# Altium schematic sheet Sheet1.SchDoc
size A; SheetNumber: 1; SheetTotal: 1; Rule: UNIONINDEX=0|RULEKIND=Width|NETSCOPE=AnyNet|LAYERKIND=SameLayer|NAME=Schematic Width Constraint|MAXLIMIT=30mil|MINLIMIT=30mil|PREFEREDWIDTH=30mil|MIDLAYER1_MINWIDTH=10mil|MIDLAYER1_MAXWIDTH=10mil|MIDLAYER1_PREFWIDTH=10mil|MIDLAYER2_MINWIDTH=10mil|MIDLAYER2_MAXWIDTH=10mil|MIDLAYER2_PREFWIDTH=10mil|MIDLAYER3_MINWIDTH=10mil|MIDLAYER3_MAXWIDTH=10mil|MIDLAYER3_PREFWIDTH=10mil|MIDLAYER4_MINWIDTH=10mil|MIDLAYER4_MAXWIDTH=10mil|MIDLAYER4_PREFWIDTH=10mil|MIDLAYER5_MINWIDTH=10mil|MIDLAYER5_MAXWIDTH=10mil|MIDLAYER5_PREFWIDTH=10mil|MIDLAYER6_MINWIDTH=10mil|MIDLAYER6_MAXWIDTH=10mil|MIDLAYER6_PREFWIDTH=10mil|MIDLAYER7_MINWIDTH=10mil|MIDLAYER7_MAXWIDTH=10mil|MIDLAYER7_PREFWIDTH=10mil|MIDLAYER8_MINWIDTH=10mil|MIDLAYER8_MAXWIDTH=10mil|MIDLAYER8_PREFWIDTH=10mil|MIDLAYER9_MINWIDTH=10mil|MIDLAYER9_MAXWIDTH=10mil|MIDLAYER9_PREFWIDTH=10mil|MIDLAYER10_MINWIDTH=10mil|MIDLAYER10_MAXWIDTH=10mil|MIDLAYER10_PREFWIDTH=10mil|MIDLAYER11_MINWIDTH=10mil|MIDLAYER11_MAXWIDTH=10mil|MIDLAYER11_PREFWIDTH=10mil|MIDLAYER12_MINWIDTH=10mil|MIDLAYER12_MAXWIDTH=10mil|MIDLAYER12_PREFWIDTH=10mil|MIDLAYER13_MINWIDTH=10mil|MIDLAYER13_MAXWIDTH=10mil|MIDLAYER13_PREFWIDTH=10mil|MIDLAYER14_MINWIDTH=10mil|MIDLAYER14_MAXWIDTH=10mil|MIDLAYER14_PREFWIDTH=10mil|MIDLAYER15_MINWIDTH=10mil|MIDLAYER15_MAXWIDTH=10mil|MIDLAYER15_PREFWIDTH=10mil|MIDLAYER16_MINWIDTH=10mil|MIDLAYER16_MAXWIDTH=10mil|MIDLAYER16_PREFWIDTH=10mil|MIDLAYER17_MINWIDTH=10mil|MIDLAYER17_MAXWIDTH=10mil|MIDLAYER17_PREFWIDTH=10mil|MIDLAYER18_MINWIDTH=10mil|MIDLAYER18_MAXWIDTH=10mil|MIDLAYER18_PREFWIDTH=10mil|MIDLAYER19_MINWIDTH=10mil|MIDLAYER19_MAXWIDTH=10mil|MIDLAYER19_PREFWIDTH=10mil|MIDLAYER20_MINWIDTH=10mil|MIDLAYER20_MAXWIDTH=10mil|MIDLAYER20_PREFWIDTH=10mil|MIDLAYER21_MINWIDTH=10mil|MIDLAYER21_MAXWIDTH=10mil|MIDLAYER21_PREFWIDTH=10mil|MIDLAYER22_MINWIDTH=10mil|MIDLAYER22_MAXWIDTH=10mil|MIDLAYER22_PREFWIDTH=10mil|MIDLAYER23_MINWIDTH=10mil|MIDLAYER23_MAXWIDTH=10mil|MIDLAYER23_PREFWIDTH=10mil|MIDLAYER24_MINWIDTH=10mil|MIDLAYER24_MAXWIDTH=10mil|MIDLAYER24_PREFWIDTH=10mil|MIDLAYER25_MINWIDTH=10mil|MIDLAYER25_MAXWIDTH=10mil|MIDLAYER25_PREFWIDTH=10mil|MIDLAYER26_MINWIDTH=10mil|MIDLAYER26_MAXWIDTH=10mil|MIDLAYER26_PREFWIDTH=10mil|MIDLAYER27_MINWIDTH=10mil|MIDLAYER27_MAXWIDTH=10mil|MIDLAYER27_PREFWIDTH=10mil|MIDLAYER28_MINWIDTH=10mil|MIDLAYER28_MAXWIDTH=10mil|MIDLAYER28_PREFWIDTH=10mil|MIDLAYER29_MINWIDTH=10mil|MIDLAYER29_MAXWIDTH=10mil|MIDLAYER29_PREFWIDTH=10mil|MIDLAYER30_MINWIDTH=10mil|MIDLAYER30_MAXWIDTH=10mil|MIDLAYER30_PREFWIDTH=10mil|MINIMP=50.000000|MAXIMP=50.000000|FAVIMP=50.000000|UNIT=Imperial
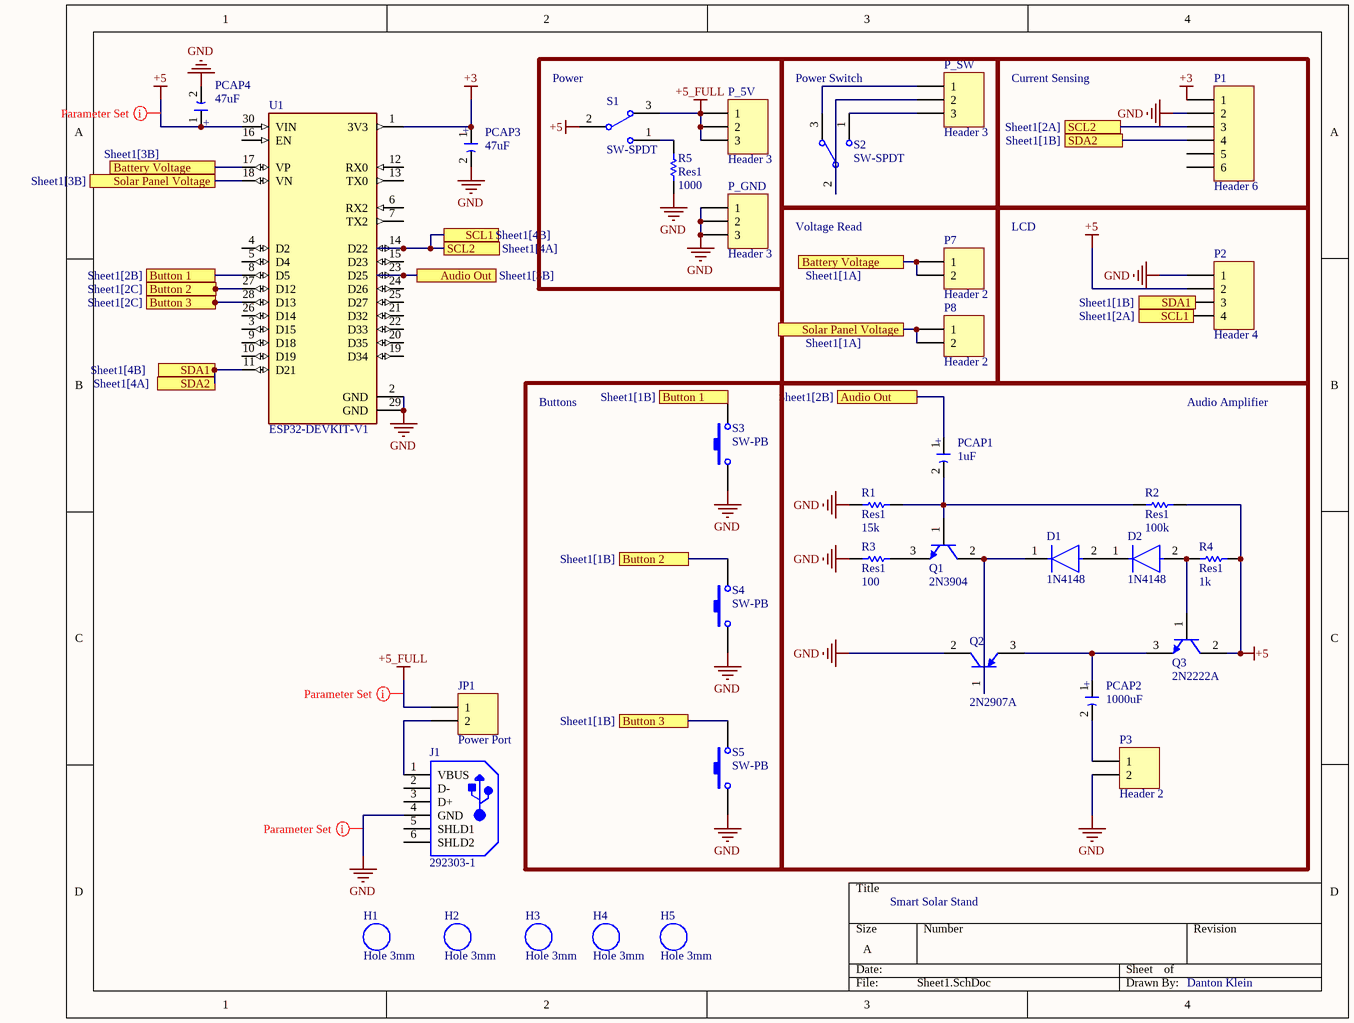
[diagram p0: Sheet1.SchDoc]

## Parts
D1  1N4148  [FP-017AG-MFG]
D2  1N4148  [FP-017AG-MFG]
H1  Hole 3mm  [Hole 3mm]
H2  Hole 3mm  [Hole 3mm]
H3  Hole 3mm  [Hole 3mm]
H4  Hole 3mm  [Hole 3mm]
H5  Hole 3mm  [Hole 3mm]
J1  292303-1  [TE-292303-1_V]
JP1  Power Port  [CON2screw]
P1  Header 6  [HDR1X6]
P2  Header 4  [HDR1X4]
P3  Header 2  [HDR1X2]
P7  Header 2  [HDR1X2]
P8  Header 2  [HDR1X2]
P_5V  Header 3  [HDR1X3]
P_GND  Header 3  [HDR1X3]
P_SW  Header 3  [HDR1X3]
PCAP1  1uF  [P Cap - Small]
PCAP2  1000uF  [P Cap - Small]
PCAP3  47uF  [P Cap - Small]
PCAP4  47uF  [P Cap - Small]
Q1  2N3904  [STM-TO-18-3]
Q2  2N2907A  [STM-TO-18-3]
Q3  2N2222A  [STM-TO-18-3]
R1  Res1  value 15k  [AXIAL-0.3]
R2  Res1  value 100k  [AXIAL-0.3]
R3  Res1  value 100  [AXIAL-0.3]
R4  Res1  value 1k  [AXIAL-0.3]
R5  Res1  value 1000  [AXIAL-0.3]
S1  SW-SPDT  [SW DPST jameco]
S2  SW-SPDT  [SW DPST jameco]
S3  SW-PB  [SW PB]
S4  SW-PB  [SW PB]
S5  SW-PB  [SW PB]
U1  ESP32-DEVKIT-V1  [MODULE_ESP32_DEVKIT_V1_NOKEEPOUT]

## Blocks framed on the sheet
Power: P_5V P_GND R5 S1
Power Switch: P_SW S2
Current Sensing: P1
Voltage Read: P7 P8
LCD: P2
Buttons: S3-S5
Audio Amplifier: D1 D2 P3 PCAP1 PCAP2 Q1-Q3 R1-R4

## Ports
Audio Out (see Sheet1[2B]), Audio Out (see Sheet1[3B]), Battery Voltage (see Sheet1[1A]), Battery Voltage (see Sheet1[3B]), Button 1 (see Sheet1[1B]), Button 1 (see Sheet1[2B]), Button 2 (see Sheet1[1B]), Button 2 (see Sheet1[2C]), Button 3 (see Sheet1[1B]), Button 3 (see Sheet1[2C]), SCL1 (see Sheet1[2A]), SCL1 (see Sheet1[4B]), SCL2 (see Sheet1[2A]), SCL2 (see Sheet1[4A]), SDA1 (see Sheet1[1B]), SDA1 (see Sheet1[4B]), SDA2 (see Sheet1[1B]), SDA2 (see Sheet1[4A]), Solar Panel Voltage (see Sheet1[1A]), Solar Panel Voltage (see Sheet1[3B])

## Nets
+3: P1.1 PCAP3.1 U1.1(3V3)
+5: P2.2 PCAP4.1 Q3.2(C) R2.2 R4.2 S1.2 U1.30(VIN)
+5_FULL: JP1.1 P_5V.1 P_5V.2 P_5V.3 S1.3
GND: J1.4(GND) P1.2 P2.1 P3.2 P_GND.1 P_GND.2 P_GND.3 PCAP3.2 PCAP4.2 Q2.2(C) R1.1 R3.1 R5.1 S3.1 S4.1 S5.1 U1.2(GND) U1.29(GND)
Audio Out: PCAP1.1 U1.23(D25) ; port Audio Out
Battery Voltage: P7.1 P7.2 U1.17(VP) ; port Battery Voltage
Button 1: S3.2 U1.8(D5) ; port Button 1
Button 2: S4.2 U1.27(D12) ; port Button 2
Button 3: S5.2 U1.28(D13) ; port Button 3
SCL1: P1.3 U1.14(D22) ; port SCL2, port SCL1
SDA1: P1.4 U1.11(D21) ; port SDA2, port SDA1
Solar Panel Voltage: P8.1 P8.2 U1.18(VN) ; port Solar Panel Voltage
NetD1_1: D1.1(C) Q1.2(C) Q2.1(B)
NetD1_2: D1.2(A) D2.1(C)
NetD2_2: D2.2(A) Q3.1(B) R4.1
NetJ1_1: J1.1(VBUS) JP1.2
NetP3_1: P3.1 PCAP2.2
NetP_SW_1: P_SW.1 S2.3
NetP_SW_2: P_SW.2 S2.2
NetP_SW_3: P_SW.3 S2.1
NetPCAP1_2: PCAP1.2 Q1.1(B) R1.2 R2.1
NetPCAP2_1: PCAP2.1 Q2.3(E) Q3.3(E)
NetQ1_3: Q1.3(E) R3.2
NetR5_2: R5.2 S1.1

Not connected (* = marked no-connect by the designer): J1 2(D-) 3(D+) 5(SHLD1) 6(SHLD2); P1 5 6; P2 3 4; U1 3(D15) 4(D2) 5(D4) 6(RX2) 7(TX2) 9(D18) 10(D19) 12(RX0) 13(TX0) 15(D23) 16(EN) 19(D34) 20(D35) 21(D32) 22(D33) 24(D26) 25(D27) 26(D14)

## Notes on the sheet
- Smart Solar Stand
- Danton Klein
- (in symbol P Cap) +

## Library data of the parts
D1 D2 = CMP-07163-000046-1: DIODE GEN PURP 100V 200MA DO35; Forward Voltage: 1V; Max Power Dissipation: 500mW; Max Reverse Current: 5uA; Forward Current: 300mA; Current: 4A; Reverse Recovery Time: 4ns; Element Configuration: Single; Outside Diameter: 1.85mm; Capacitance: 4pF; Polarity: Standard; Max Forward Surge Current (Ifsm): 1A; Reverse Voltage: 100V; Output Current: 200mA; Average Rectified Current: 200mA; Diameter: 1.91mm; Max Repetitive Reverse Voltage (Vrrm): 100V; Current Rating: 200mA; Case/Package: DO-35; Lead Free: Lead Free; Number of Pins: 2; Recovery Time: 4ns; Packaging: Bulk; Contact Plating: Tin; Voltage: 100V; Mount: Through Hole; Max Surge Current: 4A; Package Quantity: 2000; Width: 1.91mm; Max Reverse Voltage (DC): 100V; Length: 4.56mm; Radiation Hardening: No; Power Dissipation: 500mW; Voltage Rating (DC): 100V; Peak Non-Repetitive Surge Current: 4A; REACH SVHC: No SVHC; Height: 4.56mm; Max Operating Temperature: 175°C; Series: -; Weight: 0.01lb; Min Operating Temperature: -65°C
J1 = CMP-2000-05404-1: 1 Port Right Angle Through Hole Mount Female Type A USB Connector, 4 Position, -55 to 85 degC, RoHS, Tube; Manufacturer: TE Connectivity; Contact Termination Type: Solder; No. of Contacts: 4; Connector Mounting: PCB; SVHC: NoSVHC(16-Jun-2014); Gender: Receptacle; Connector Type: USBA; Package Description: 4-Pin Through Hole Device, Body 14 x 13.13 mm, Pitch 2.5 mm; Contact Plating: Gold; Package Reference: 292303-1; Contact Material: Copper; Datasheet URL: http://www.farnell.com/cad/1653030.pdf; Datasheet Version: Feb-12; Manufacturer URL: http://www.te.com/
JP1 = Power
P1 = Header 6: Header, 6-Pin; LatestRevisionDate: 17-Jul-2002; LatestRevisionNote: Re-released for DXP Platform.; Publisher: Altium Limited
P2 = Header 4: Header, 4-Pin; LatestRevisionDate: 17-Jul-2002; LatestRevisionNote: Re-released for DXP Platform.; Publisher: Altium Limited
P3 P7 P8 = Header 2: Header, 2-Pin; LatestRevisionDate: 17-Jul-2002; LatestRevisionNote: Re-released for DXP Platform.; Publisher: Altium Limited
P_5V P_GND P_SW = Header 3: Header, 3-Pin; LatestRevisionDate: 17-Jul-2002; LatestRevisionNote: Re-released for DXP Platform.; Publisher: Altium Limited
PCAP1-PCAP4 = P Cap
Q1 Q3 = CMP-2000-05381-1: High Speed Switch, 0.6 A IC, -65 to 175 degC, 3-Pin TO-18, RoHS, Bulk; Manufacturer: STMicroelectronics; Power Dissipation Pd: 500mW; DC Current Gain hFE: 300hFE; Transistor Polarity: NPN; DC Collector Current: 600mA; No. of Pins: 3Pins; Transition Frequency ft: 300MHz; Collector Emitter Voltage V(br)ceo: 40V; Product Range: -; Package Reference: TO-18-3; Datasheet URL: https://datasheet.ciiva.com/25917/cd00003223-25917094.pdf; Automotive Qualification Standard: -; Transistor Case Style: TO-18; Operating Temperature Max: 175degC; Datasheet Version: Feb-03; Package Description: 3-Pin Through Hole Device, Dia 5.8 mm, Pitch 1.27 mm; Manufacturer URL: http://www.st.com/
Q2 = CMP-2000-05561-1: Small Signal PNP Transistor, 0.4 W, 60 V, 600 mA, 3-Pin TO-18, RoHS, Bulk; Manufacturer: STMicroelectronics; Transition Frequency ft: 200MHz; Collector Emitter Voltage V(br)ceo: -60V; Power Dissipation Pd: 400mW; No. of Pins: 3Pins; SVHC: NoSVHC(17-Dec-2015); DC Collector Current: -600mA; DC Current Gain hFE: 300hFE; MSL: -; Operating Temperature Max: 175°C; Product Range: -; Datasheet Version: 02/2003; Automotive Qualification Standard: -; Transistor Case Style: TO-18; Manufacturer URL: http://www.st.com/; Mounting Technology: ThroughHole; Package Description: 3-Pin Through Hole Device, Dia 5.8 mm, Pitch 1.27 mm; Package Reference: TO-18-3; Datasheet URL: https://datasheet.ciiva.com/16614/cd00003088-16614659.pdf; Transistor Polarity: PNP
R1-R5 = Res1: Resistor; Published: 8-Jun-2000; LatestRevisionDate: 17-Jul-2002; LatestRevisionNote: Re-released for DXP Platform.; PackageReference: AXIAL-0.3; Publisher: Altium Limited; PackageDescription: Axial Device, Thru-Hole; 2 Leads; 0.3 in Pin Spacing
S1 S2 = SW-SPDT: SPDT Subminiature Toggle Switch, Right Angle Mounting, Vertical Actuation; Published: 24-Mar-1999; LatestRevisionDate: 17-Dec-2003; LatestRevisionNote: Schematic revised, PCB Footprint replaced.; DatasheetVersion: 05-Dec-2000; PackageReference: TL36WW15050; Publisher: Altium Limited; PackageDescription: Switch; 4 Leads; ComponentLink1Description: Manufacturer Link; ComponentLink1URL: http://www.apem.com
S3-S5 = SW-PB: DIGIKEY SW400-ND; Published: 24-Mar-1999; LatestRevisionDate: 17-Jul-2002; LatestRevisionNote: Re-released for DXP Platform.; Publisher: Altium Limited
U1 = ESP32-DEVKIT-V1: Dual core, Wi-Fi: 2.4 GHz up to 150 Mbits/s,BLE (Bluetooth Low Energy) and legacy Bluetooth, 32 bits, Up to 240 MHz; MF: Do it; Price: None; Availability: Not in stock; Package: None; MP: ESP32-DEVKIT-V1; Value: *; SnapEDA_Link: https://www.snapeda.com/parts/ESP32-DEVKIT-V1/Do+it/view-part/?ref=snap; Check_prices: https://www.snapeda.com/parts/ESP32-DEVKIT-V1/Do+it/view-part/?ref=eda